# Altium project wes_iot.PrjPcb
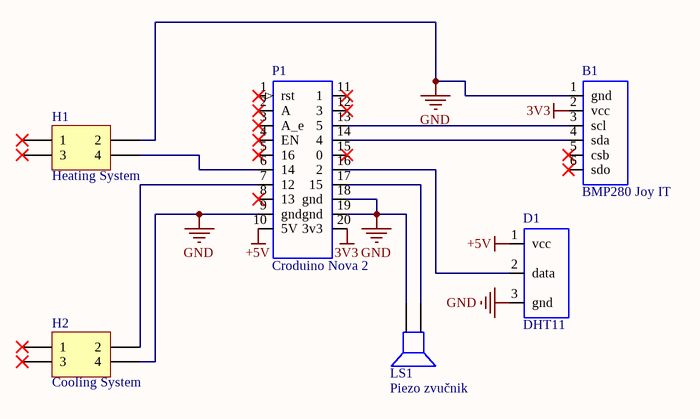
[diagram p0: wes_iot.SchDoc]
1 sheet, 6 parts. Net scope: global (net labels, ports and power ports of the same name join across sheets).
Board file: wes-iot.PcbDoc

## Sheet wes_iot.SchDoc
size A4

### Parts
B1  BMP280 Joy IT  [BMP280 Joy IT]
D1  DHT11  [PCBComponent_1]
H1  Heating System  [HDR2X2]
H2  Cooling System  [HDR2X2]
LS1  Piezo zvučnik  [PIN2]
P1  Croduino Nova 2  [Croduino Nova 2]

### Nets
3V3: B1.2(vcc) P1.20(3v3)
+5V: D1.1(vcc) P1.10(5V)
GND: B1.1(gnd) D1.3(gnd) H1.2 H2.4 LS1.2 P1.9(gnd) P1.18(gnd) P1.19(gnd)
NetB1_3: B1.3(scl) P1.13(5)
NetB1_4: B1.4(sda) P1.14(4)
NetD1_2: D1.2(data) P1.16(2)
NetH1_4: H1.4 P1.6(14)
NetH2_2: H2.2 P1.7(12)
NetLS1_1: LS1.1 P1.17(15)

Not connected (* = marked no-connect by the designer): B1 5(csb)* 6(sdo)*; H1 1* 3*; H2 1* 3*; P1 1(rst)* 2(A)* 3(A_e)* 4(EN)* 5(16)* 8(13)* 11(1)* 12(3)* 15(0)*

### Library data of the parts
H1 H2 = Header 2X2: Header, 2-Pin, Dual row; LatestRevisionDate: 17-Jul-2002; LatestRevisionNote: Re-released for DXP Platform.; Publisher: Altium Limited
LS1 = Speaker: Loudspeaker; Published: 24-Mar-1999; LatestRevisionDate: 17-Jul-2002; LatestRevisionNote: Re-released for DXP Platform.; PackageReference: PIN2; Publisher: Altium Limited